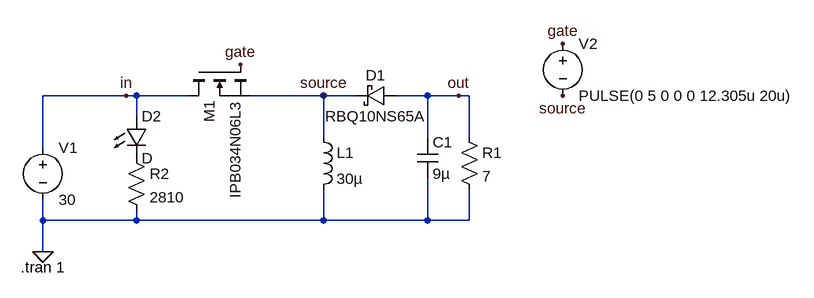
[diagram p0: schematic Power Converter Version 1.2.asc]
Power Converter Version 1.2.asc, the LTspice schematic file:
Version 4
SHEET 1 1064 680
WIRE 16 48 -112 48
WIRE 32 48 16 48
WIRE 112 48 32 48
WIRE 320 48 208 48
WIRE 368 48 320 48
WIRE 480 48 432 48
WIRE 528 48 480 48
WIRE 544 48 528 48
WIRE 32 80 32 48
WIRE 320 112 320 48
WIRE 480 112 480 48
WIRE 544 112 544 48
WIRE -112 128 -112 48
WIRE -112 240 -112 208
WIRE 32 240 32 224
WIRE 32 240 -112 240
WIRE 320 240 320 192
WIRE 320 240 32 240
WIRE 480 240 480 176
WIRE 480 240 320 240
WIRE 544 240 544 192
WIRE 544 240 480 240
WIRE -112 288 -112 240
FLAG -112 288 0
FLAG 192 0 gate
FLAG 688 -32 gate
FLAG 320 48 source
FLAG 688 48 source
FLAG 16 48 in
FLAG 528 48 out
SYMBOL voltage -112 112 R0
WINDOW 123 0 0 Left 0
WINDOW 39 0 0 Left 0
SYMATTR InstName V1
SYMATTR Value 30
SYMBOL voltage 688 -48 R0
WINDOW 123 0 0 Left 0
WINDOW 39 0 0 Left 0
SYMATTR InstName V2
SYMATTR Value PULSE(0 5 0 0 0 12.305u 20u)
SYMBOL res 528 96 R0
SYMATTR InstName R1
SYMATTR Value 7
SYMBOL schottky 432 32 R90
WINDOW 0 0 32 VBottom 2
WINDOW 3 32 32 VTop 2
SYMATTR InstName D1
SYMATTR Value RBQ10NS65A
SYMATTR Description Diode
SYMATTR Type diode
SYMBOL ind 304 96 R0
SYMATTR InstName L1
SYMATTR Value 30µ
SYMATTR SpiceLine Rser=3.6m
SYMBOL cap 464 112 R0
SYMATTR InstName C1
SYMATTR Value 9µ
SYMBOL nmos 112 0 M90
SYMATTR InstName M1
SYMATTR Value IPB034N06L3
SYMBOL LED 16 80 R0
SYMATTR InstName D2
SYMBOL res 16 128 R0
SYMATTR InstName R2
SYMATTR Value 2810
TEXT -146 312 Left 2 !.tran 1

The netlist it stands for:
* Power Converter Version 1.2.asc
V1 in 0 30
V2 gate source PULSE(0 5 0 0 0 12.305u 20u)
R1 out 0 7
D1 out source RBQ10NS65A
L1 source 0 30µ Rser=3.6m
C1 out 0 9µ
M1 in gate source source IPB034N06L3
D2 in P001 D
R2 P001 0 2810
.model D D
.lib standard.dio
.model NMOS NMOS
.model PMOS PMOS
.lib standard.mos
.tran 1
.backanno
.end